# EAGLE design BBB_Proto_Cape (EAGLE 6.3)
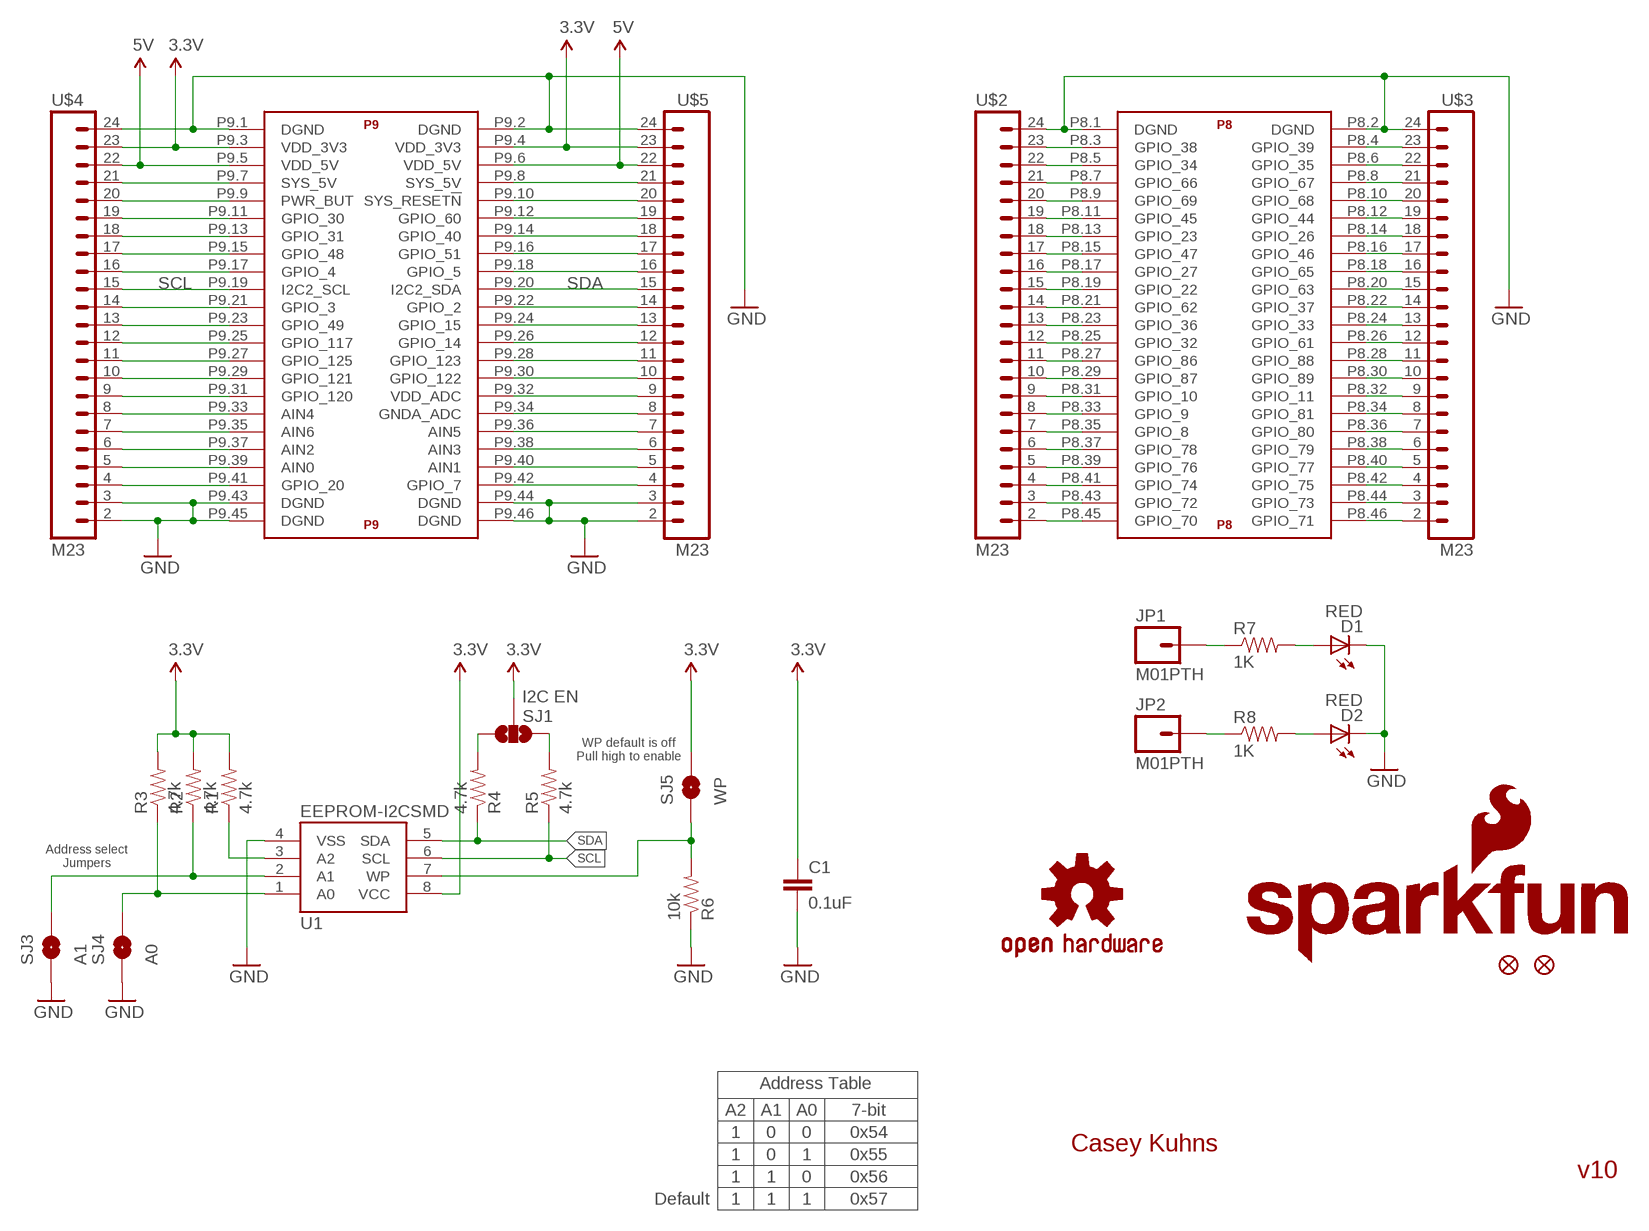
[diagram p0: schematic, sheet 1]

## Parts
C1  0.1uF  0.1UF-25V(+80/-20%)(0603)  [0603-CAP]
D1  RED  LED-RED0603  [LED-0603]
D2  RED  LED-RED0603  [LED-0603]
FID1  FIDUCIAL1X2  [FIDUCIAL-1X2]
FID2  FIDUCIAL1X2  [FIDUCIAL-1X2]
JP1  M01PTH  [1X01]
JP2  M01PTH  [1X01]
LOGO2  OSHW-LOGOS  [OSHW-LOGO-S]
LOGO3  SFE_LOGO_NAME_FLAME.1_INCH  [SFE_LOGO_NAME_FLAME_.1]
R1  4.7k  4.7KOHM1/10W1%(0603)  [0603]
R2  4.7k  4.7KOHM1/10W1%(0603)  [0603]
R3  4.7k  4.7KOHM1/10W1%(0603)  [0603]
R4  4.7k  4.7KOHM1/10W1%(0603)  [0603]
R5  4.7k  4.7KOHM1/10W1%(0603)  [0603]
R6  10k  10KOHM1/10W1%(0603)0603  [0603-RES]
R7  1K  1KOHM1/10W1%(0603)  [0603-RES]
R8  1K  1KOHM1/10W1%(0603)  [0603-RES]
SJ1  I2C EN  SOLDERJUMPER_2WAYPASTE1&2&3  [SJ_3_PASTE1&2&3]
SJ3  A1  SOLDERJUMPERNO  [SJ_2S-NO]
SJ4  A0  SOLDERJUMPERNO  [SJ_2S-NO]
SJ5  WP  SOLDERJUMPERNO  [SJ_2S-NO]
U1  EEPROM-I2CSMD  [SO08]
U$1  BEAGLE_BONE_BLACK_CAPE  [BEAGLE_BONE_BLACK_CAPE]
U$2  M23  [1X23]
U$3  M23  [1X23]
U$4  M23  [1X23]
U$5  M23  [1X23]

## Nets
3.3V: C1.1 R1.2 R2.2 R3.2 SJ1.2 SJ5.2 U1.8(VCC) U$1.P9.3(P9:VDD_3V3) U$1.P9.4(P9:VDD_3V3) U$4.23 U$5.23
5V: U$1.P9.5(P9:VDD_5V) U$1.P9.6(P9:VDD_5V) U$4.22 U$5.22
A0: R3.1 SJ4.2 U1.1(A0)
A1: R2.1 SJ3.2 U1.2(A1)
GND: C1.2 D1.C D2.C R6.1 SJ3.1 SJ4.1 U1.4(VSS) U$1.P8.1(P8:DGND) U$1.P8.2(P8:DGND) U$1.P9.1(P9:DGND) U$1.P9.2(P9:DGND) U$1.P9.43(P9:DGND) U$1.P9.44(P9:DGND) U$1.P9.45(P9:DGND) U$1.P9.46(P9:DGND) U$2.24 U$3.24 U$4.2 U$4.3 U$4.24 U$5.2 U$5.3 U$5.24
N$1: R6.2 SJ5.1 U1.7(WP)
N$2: U$1.P8.45(P8:GPIO_70) U$2.2
N$3: D1.A R7.2
N$4: U$1.P8.43(P8:GPIO_72) U$2.3
N$5: U$1.P8.41(P8:GPIO_74) U$2.4
N$6: R1.1 U1.3(A2)
N$7: D2.A R8.2
N$8: JP1.1 R7.1
N$9: U$1.P8.39(P8:GPIO_76) U$2.5
N$10: R4.2 SJ1.3
N$11: R5.2 SJ1.1
N$12: U$1.P8.37(P8:GPIO_78) U$2.6
N$13: U$1.P8.35(P8:GPIO_8) U$2.7
N$14: U$1.P8.33(P8:GPIO_9) U$2.8
N$15: U$1.P8.31(P8:GPIO_10) U$2.9
N$16: U$1.P8.29(P8:GPIO_87) U$2.10
N$17: U$1.P8.27(P8:GPIO_86) U$2.11
N$18: U$1.P8.25(P8:GPIO_32) U$2.12
N$19: U$1.P8.23(P8:GPIO_36) U$2.13
N$20: U$1.P8.21(P8:GPIO_62) U$2.14
N$21: U$1.P8.19(P8:GPIO_22) U$2.15
N$22: U$1.P8.17(P8:GPIO_27) U$2.16
N$23: U$1.P8.15(P8:GPIO_47) U$2.17
N$24: U$1.P8.13(P8:GPIO_23) U$2.18
N$25: U$1.P8.11(P8:GPIO_45) U$2.19
N$26: U$1.P8.9(P8:GPIO_69) U$2.20
N$27: U$1.P8.7(P8:GPIO_66) U$2.21
N$28: U$1.P8.5(P8:GPIO_34) U$2.22
N$29: U$1.P8.3(P8:GPIO_38) U$2.23
N$30: JP2.1 R8.1
N$31: U$1.P8.46(P8:GPIO_71) U$3.2
N$32: U$1.P8.44(P8:GPIO_73) U$3.3
N$33: U$1.P8.42(P8:GPIO_75) U$3.4
N$34: U$1.P8.40(P8:GPIO_77) U$3.5
N$35: U$1.P8.38(P8:GPIO_79) U$3.6
N$36: U$1.P8.36(P8:GPIO_80) U$3.7
N$37: U$1.P8.34(P8:GPIO_81) U$3.8
N$38: U$1.P8.32(P8:GPIO_11) U$3.9
N$39: U$1.P8.30(P8:GPIO_89) U$3.10
N$40: U$1.P8.28(P8:GPIO_88) U$3.11
N$41: U$1.P8.26(P8:GPIO_61) U$3.12
N$42: U$1.P8.24(P8:GPIO_33) U$3.13
N$43: U$1.P8.22(P8:GPIO_37) U$3.14
N$44: U$1.P8.20(P8:GPIO_63) U$3.15
N$45: U$1.P8.18(P8:GPIO_65) U$3.16
N$46: U$1.P8.16(P8:GPIO_46) U$3.17
N$47: U$1.P8.14(P8:GPIO_26) U$3.18
N$48: U$1.P8.12(P8:GPIO_44) U$3.19
N$49: U$1.P8.10(P8:GPIO_68) U$3.20
N$50: U$1.P8.8(P8:GPIO_67) U$3.21
N$51: U$1.P8.6(P8:GPIO_35) U$3.22
N$52: U$1.P8.4(P8:GPIO_39) U$3.23
N$56: U$1.P9.42(P9:GPIO_7) U$5.4
N$57: U$1.P9.40(P9:AIN1) U$5.5
N$58: U$1.P9.38(P9:AIN3) U$5.6
N$59: U$1.P9.36(P9:AIN5) U$5.7
N$60: U$1.P9.34(P9:GNDA_ADC) U$5.8
N$61: U$1.P9.32(P9:VDD_ADC) U$5.9
N$62: U$1.P9.30(P9:GPIO_122) U$5.10
N$63: U$1.P9.28(P9:GPIO_123) U$5.11
N$64: U$1.P9.26(P9:GPIO_14) U$5.12
N$65: U$1.P9.24(P9:GPIO_15) U$5.13
N$66: U$1.P9.22(P9:GPIO_2) U$5.14
N$68: U$1.P9.18(P9:GPIO_5) U$5.16
N$69: U$1.P9.16(P9:GPIO_51) U$5.17
N$70: U$1.P9.14(P9:GPIO_40) U$5.18
N$71: U$1.P9.12(P9:GPIO_60) U$5.19
N$72: U$1.P9.10(P9:SYS_RESET!N) U$5.20
N$73: U$1.P9.8(P9:SYS_5V) U$5.21
N$79: U$1.P9.41(P9:GPIO_20) U$4.4
N$80: U$1.P9.39(P9:AIN0) U$4.5
N$81: U$1.P9.37(P9:AIN2) U$4.6
N$82: U$1.P9.35(P9:AIN6) U$4.7
N$83: U$1.P9.33(P9:AIN4) U$4.8
N$84: U$1.P9.31(P9:GPIO_120) U$4.9
N$85: U$1.P9.29(P9:GPIO_121) U$4.10
N$86: U$1.P9.27(P9:GPIO_125) U$4.11
N$87: U$1.P9.25(P9:GPIO_117) U$4.12
N$88: U$1.P9.23(P9:GPIO_49) U$4.13
N$89: U$1.P9.21(P9:GPIO_3) U$4.14
N$91: U$1.P9.17(P9:GPIO_4) U$4.16
N$92: U$1.P9.15(P9:GPIO_48) U$4.17
N$93: U$1.P9.13(P9:GPIO_31) U$4.18
N$94: U$1.P9.11(P9:GPIO_30) U$4.19
N$95: U$1.P9.9(P9:PWR_BUT) U$4.20
N$96: U$1.P9.7(P9:SYS_5V) U$4.21
SCL: R5.1 U1.6(SCL) U$1.P9.19(P9:I2C2_SCL) U$4.15
SDA: R4.1 U1.5(SDA) U$1.P9.20(P9:I2C2_SDA) U$5.15

## Notes on the sheet
- WP default is off
  Pull high to enable
- Address select
  Jumpers
- Address Table
- A2 | A1 | A0 | 7-bit
- 1 | 0 | 0 | 0x54
- Casey Kuhns
- 1 | 0 | 1 | 0x55
- 1 | 1 | 0 | 0x56 | v10
- Default | 1 | 1 | 1 | 0x57

## Library data of the parts
C1 = SparkFun-Capacitors:0.1UF-25V(+80/-20%)(0603): CAP-00810 Ceramic Standard decoupling cap; PROD_ID: CAP-00810
D1 D2 = SparkFun-LED:LED-RED: Assorted Red LEDs LilyPad 1206- DIO-09912 1206- DIO-00809 0603- DIO-00819; PROD_ID: DIO-00819
FID1 FID2 = SparkFun-Aesthetics:FIDUCIAL: Fiducial Alignment Points Various fiducial points for machine vision alignment.
JP1 JP2 = SparkFun-Connectors:M01: Header 1 Standard 1-pin 0.1" header. Use with straight break away headers (SKU : PRT-00116), right angle break away headers (PRT-00553), swiss pins (PRT-00743), machine pins (PRT-00117), and female headers (PRT-00115).
LOGO2 = SparkFun-Aesthetics:OSHW-LOGO: Open Source Hardware Logo This logo indicates the piece of hardware it is found on incorporates a OSHW license and/or adheres to the definition of open source hardware found here: http://freedomdefined.org/OSHW
LOGO3 = SparkFun-Aesthetics:SFE_LOGO_NAME_FLAME: SFE Logo, name and flame This is the SparkFun full logo. The logo on the schematic will always be the same size; the package variant is the height of the flame part of the logo. Default layer for the logo on the board is tSilk.
R1-R5 = SparkFun-Resistors:4.7KOHM1/10W1%(0603): RES-07857; PROD_ID: RES-07857
R6 = SparkFun-Resistors:10KOHM1/10W1%(0603): RES-00824; PROD_ID: RES-00824; VALUE: 10K
R7 R8 = SparkFun-Resistors:1KOHM1/10W1%(0603): RES-07856; PROD_ID: RES-07856
SJ1 = SparkFun-Passives:SOLDERJUMPER_2WAY: Solder Jumper 2 way solder jumper
SJ3-SJ5 = SparkFun-Passives:SOLDERJUMPER: Solder Jumper Standard SMD solder jumper. Used to automate production. Two varients : Normally Open and Normally Closed are the same, but have different paste layers. NC will have a large amount of paste and should jumper during reflow.
U1 = SparkFun-DigitalIC:EEPROM-I2C: I2C EEPROM chips, 24LC256 (and others)
U$1 = SparkFun-Boards:BEAGLE_BONE_BLACK_CAPE
U$2-U$5 = SparkFun-Connectors:M23

## Board
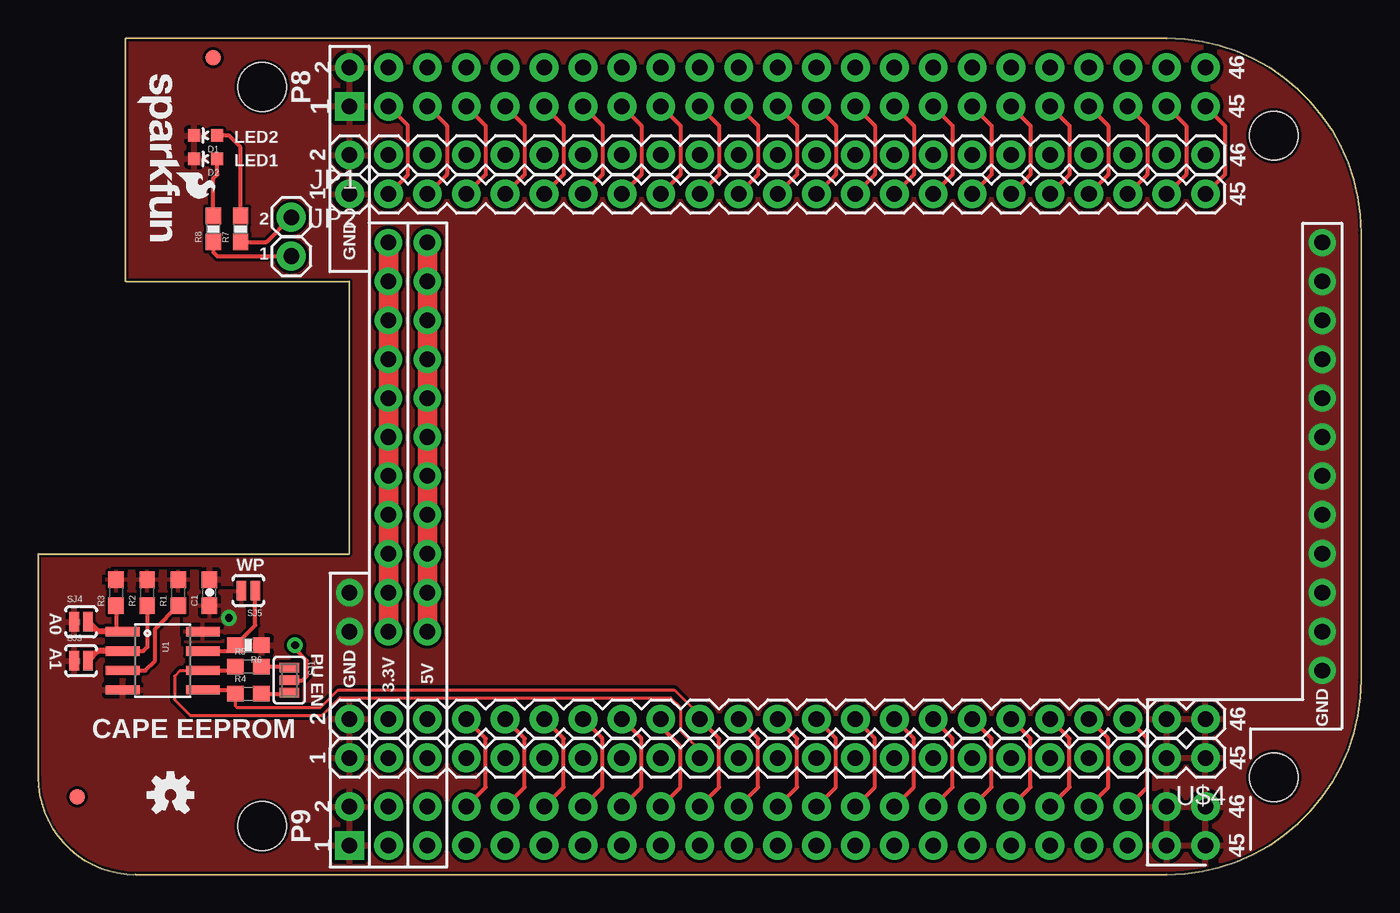
[diagram p1: board, top side]
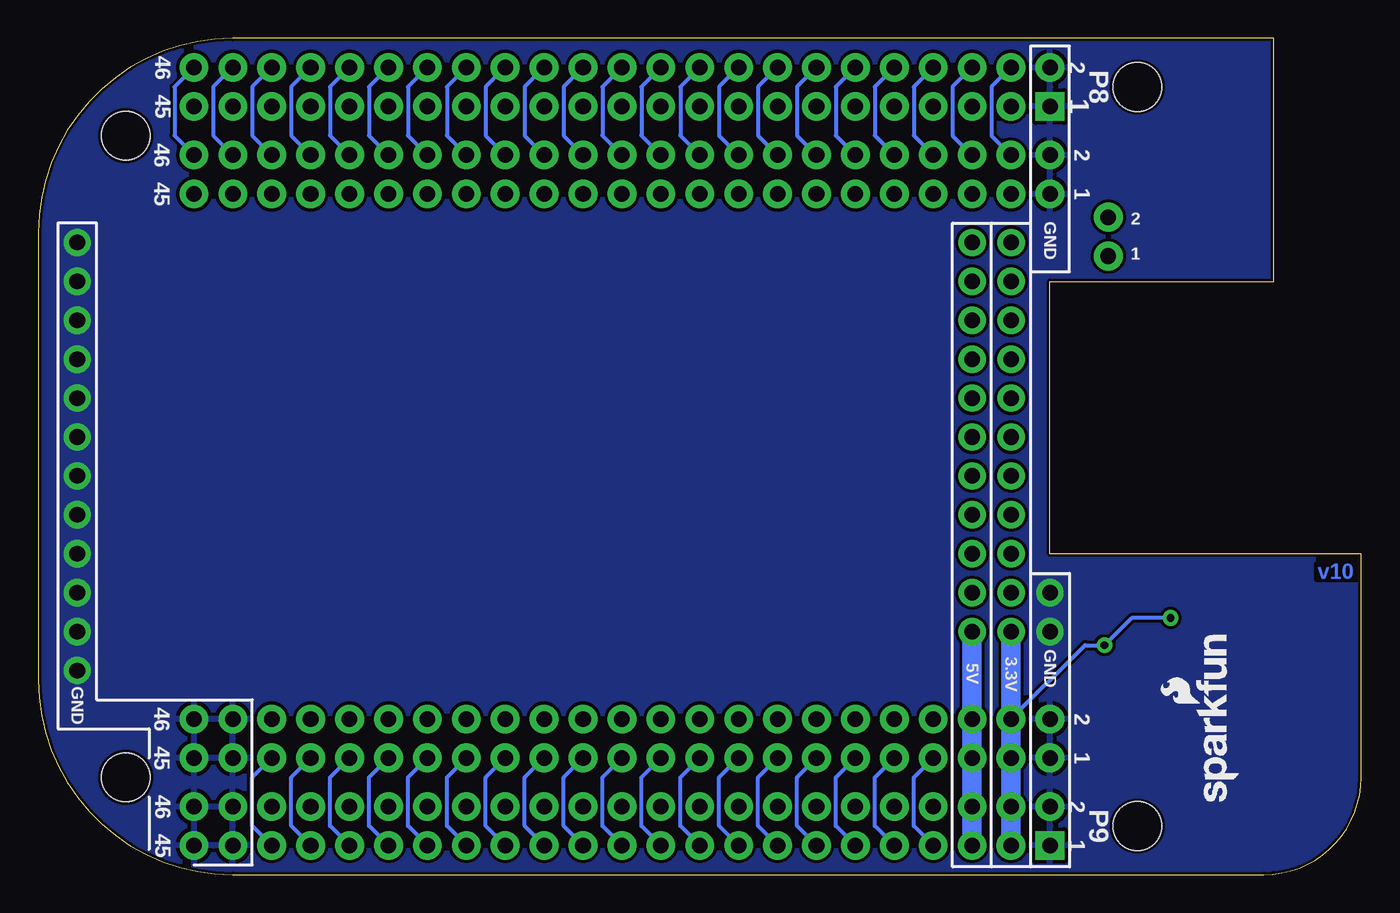
[diagram p2: board, bottom side, seen from below]

Size 86.36 x 54.61 mm. Coordinates in mm from the lower left corner, seen from the top.
Outline: 0,20.95 20.32,20.95 20.32,38.73 5.71,38.73 5.71,54.61 73.66,54.61 arc-90 86.36,41.91 86.36,12.7 arc-90 73.66,0 6.35,0 arc-90 0,6.35 0,20.95
Copper layers (1*16): Top 0.035mm / dielectric 1.5mm / Bottom 0.035mm
Design rules "SparkFun-2-layer": minimum track width 7mil, minimum drill 15mil, track to track 8mil, track to pad 8mil, pad to pad 8mil, via to via 8mil, smd to smd 8mil, copper to edge 8mil, drill to drill 8mil, minimum pad ring 12mil, minimum via ring 10mil, stop-mask expansion 4mil, vias tented up to drill 20mil, thermal gap 10mil

### Footprints (pad centres in the part's own frame; a part is rotated, then mirrored left to right if it is on the bottom)
0603-CAP = smd 1.1 x 1: 1 -0.85,0; 2 0.85,0
LED-0603 = smd 0.8 x 0.8: A 0,-0.75; C 0,0.75
FIDUCIAL-1X2 = smd 1 x 1: 1 0,0
1X01 = drill 1.016 pad 1.88: 1 0,0
0603 = smd 1.1 x 1: 1 -0.85,0; 2 0.85,0
0603-RES = smd 1.1 x 1: 1 -0.85,0; 2 0.85,0
SJ_3_PASTE1&2&3 = smd 0.635 x 1.27: 1 -0.813,0; 2 0,0; 3 0.813,0
SJ_2S-NO = smd 0.635 x 1.27: 1 -0.45,0; 2 0.45,0
SO08 = smd 0.61 x 2.21: 1 -1.905,-2.616; 2 -0.635,-2.616; 3 0.635,-2.616; 4 1.905,-2.616; 5 1.905,2.616; 6 0.635,2.616; 7 -0.635,2.616; 8 -1.905,2.616
BEAGLE_BONE_BLACK_CAPE = drill 1.016 pad 1.88 square: P8.1 20.32,50.165; P9.1 20.32,1.905 | drill 1.016 pad 1.88: P8.2 20.32,52.705; P8.3 22.86,50.165; P8.4 22.86,52.705; P8.5 25.4,50.165; P8.6 25.4,52.705; P8.7 27.94,50.165; P8.8 27.94,52.705; P8.9 30.48,50.165; P8.10 30.48,52.705; P8.11 33.02,50.165; P8.12 33.02,52.705; P8.13 35.56,50.165; P8.14 35.56,52.705; P8.15 38.1,50.165; P8.16 38.1,52.705; P8.17 40.64,50.165; P8.18 40.64,52.705; P8.19 43.18,50.165; P8.20 43.18,52.705; P8.21 45.72,50.165; P8.22 45.72,52.705; P8.23 48.26,50.165; P8.24 48.26,52.705; P8.25 50.8,50.165; P8.26 50.8,52.705; P8.27 53.34,50.165; P8.28 53.34,52.705; P8.29 55.88,50.165; P8.30 55.88,52.705; P8.31 58.42,50.165; P8.32 58.42,52.705; P8.33 60.96,50.165; P8.34 60.96,52.705; P8.35 63.5,50.165; P8.36 63.5,52.705; P8.37 66.04,50.165; P8.38 66.04,52.705; P8.39 68.58,50.165; P8.40 68.58,52.705; P8.41 71.12,50.165; P8.42 71.12,52.705; P8.43 73.66,50.165; P8.44 73.66,52.705; P8.45 76.2,50.165; P8.46 76.2,52.705; P9.2 20.32,4.445; P9.3 22.86,1.905; P9.4 22.86,4.445; P9.5 25.4,1.905; P9.6 25.4,4.445; P9.7 27.94,1.905; P9.8 27.94,4.445; P9.9 30.48,1.905; P9.10 30.48,4.445; P9.11 33.02,1.905; P9.12 33.02,4.445; P9.13 35.56,1.905; P9.14 35.56,4.445; P9.15 38.1,1.905; P9.16 38.1,4.445; P9.17 40.64,1.905; P9.18 40.64,4.445; P9.19 43.18,1.905; P9.20 43.18,4.445; P9.21 45.72,1.905; P9.22 45.72,4.445; P9.23 48.26,1.905; P9.24 48.26,4.445; P9.25 50.8,1.905; P9.26 50.8,4.445; P9.27 53.34,1.905; P9.28 53.34,4.445; P9.29 55.88,1.905; P9.30 55.88,4.445; P9.31 58.42,1.905; P9.32 58.42,4.445; P9.33 60.96,1.905; P9.34 60.96,4.445; P9.35 63.5,1.905; P9.36 63.5,4.445; P9.37 66.04,1.905; P9.38 66.04,4.445; P9.39 68.58,1.905; P9.40 68.58,4.445; P9.41 71.12,1.905; P9.42 71.12,4.445; P9.43 73.66,1.905; P9.44 73.66,4.445; P9.45 76.2,1.905; P9.46 76.2,4.445 | hole 3.175: 14.605,3.175; 80.645,6.35; 80.645,48.26; 14.605,51.435
1X23 = drill 1.016 pad 1.88: 2 -26.67,0; 3 -24.13,0; 4 -21.59,0; 5 -19.05,0; 6 -16.51,0; 7 -13.97,0; 8 -11.43,0; 9 -8.89,0; 10 -6.35,0; 11 -3.81,0; 12 -1.27,0; 13 1.27,0; 14 3.81,0; 15 6.35,0; 16 8.89,0; 17 11.43,0; 18 13.97,0; 19 16.51,0; 20 19.05,0; 21 21.59,0; 22 24.13,0; 23 26.67,0; 24 29.21,0

### Placement (x,y rotation side)
C1  11.18,18.41 90 top
D1  10.92,48.26 90 top
D2  10.92,46.74 90 top
FID1  2.54,5.08 0 top
FID2  11.43,53.34 0 top
JP1  16.51,42.93 0 top
JP2  16.51,40.39 0 top
LOGO2  8.64,5.21 0 top
LOGO3  6.35,52.7 270 top
R1  9.14,18.41 90 top
R2  7.11,18.41 90 top
R3  5.08,18.41 90 top
R4  13.72,11.81 0 top
R5  13.72,13.59 0 top
R6  13.72,14.99 180 top
R7  13.21,42.16 90 top
R8  11.43,42.16 90 top
SJ1  16.38,12.7 270 top
SJ3  2.79,13.97 0 top
SJ4  2.79,16.51 0 top
SJ5  13.72,18.54 180 top
U1  8.13,13.97 270 top
U$1  0,0 0 top
U$2  49.53,44.45 180 top
U$3  49.53,46.99 180 top
U$4  49.53,7.62 180 top
U$5  49.53,10.16 180 top
U$6  [SFE_LOGO_NAME_FLAME_.1]  7.87,4.32 90 bottom

### Tracks (layer width: path | path; a pad name or v marks a point on that pad's centre or on a via)
3.3V  (via drill 0.51, 1.02 pad 1.78)
  Top 0.254: R1.2 9.48,19.14 | SJ1.2 17.27,12.7 17.53,12.95 17.53,13.97 16.76,14.73 v16.76,14.99
  Top 1.27: v22.86,15.88 v22.86,18.41 v22.86,20.95 v22.86,23.5 v22.86,26.04 v22.86,28.57 v22.86,31.11 v22.86,33.66 v22.86,36.2 v22.86,38.73 v22.86,41.27
  Bottom 0.254: U$5.23 18.03,14.99 v16.76,14.99 14.99,16.76 v12.45,16.76
  Bottom 1.27: U$1.P9.3 U$1.P9.4 U$4.23 U$5.23 v22.86,15.88
  pour Top: 9.53,15.24 13.46,15.24 13.46,18.54 10.41,18.54 10.41,19.81 4.45,19.81 4.45,18.54 9.53,18.54
5V  (via drill 1.02 pad 1.78)
  Top 1.27: v25.4,41.27 v25.4,38.73 v25.4,36.2 v25.4,33.66 v25.4,31.11 v25.4,28.57 v25.4,26.04 v25.4,23.5 v25.4,20.95 v25.4,18.41 v25.4,15.88
  Bottom 1.27: U$1.P9.5 U$1.P9.6 U$4.22 U$5.22 v25.4,15.88
A0
  Top 0.254: R3.1 5.08,15.88 U1.1
  Top 0.406: 5.08,15.88 3.88,15.88 SJ4.2
A1
  Top 0.254: R2.1 7.11,14.86 6.86,14.61 U1.2
  Top 0.406: U1.2 3.88,14.61 SJ3.2
GND  (via drill 1.02 pad 1.78)
  other vias: 83.82,13.34 83.82,15.88 83.82,18.41 83.82,20.95 83.82,23.5 83.82,26.04 83.82,28.57 83.82,31.11 83.82,33.66 83.82,36.2 83.82,38.73 83.82,41.27 20.32,15.88 20.32,18.41
  pour Top (rank 6): 0,20.95 20.32,20.95 20.32,38.73 5.71,38.73 5.71,54.61 73.66,54.61 arc-90 86.36,41.91 86.36,12.7 arc-90 73.66,0 6.35,0 arc-90 0,6.35
  pour Bottom: 0,20.95 20.32,20.95 20.32,38.73 5.71,38.73 5.71,54.61 73.66,54.61 arc-90 86.36,41.91 86.36,12.7 arc-90 73.66,0 6.35,0 arc-90 0,6.35
N$1
  Top 0.254: SJ5.1 14.17,16.29 R6.2 12.48,14.61 U1.7
N$2
  Top 0.254: U$1.P8.45 77.47,48.9 77.47,45.72 U$2.2
N$3
  Top 0.254: R7.2 13.21,47.5 12.45,48.26 D1.A
N$4
  Top 0.254: U$1.P8.43 74.93,48.9 74.93,45.72 U$2.3
N$5
  Top 0.254: U$1.P8.41 72.39,48.9 72.39,45.72 U$2.4
N$6
  Top 0.254: U1.3 6.99,13.34 7.62,13.97 7.62,16.04 R1.1
N$7
  Top 0.254: R8.2 11.43,45.47 11.68,45.72 11.68,46.72 D2.A
N$8
  Top 0.254: R7.1 14.9,41.31 JP1.1
N$9
  Top 0.254: U$1.P8.39 69.85,48.9 69.85,45.72 U$2.5
N$10
  Top 0.254: R4.2 16.31,11.81 SJ1.3
N$11
  Top 0.254: R5.2 16.26,13.59 16.38,13.46 SJ1.1
N$12
  Top 0.254: U$1.P8.37 67.31,48.9 67.31,45.72 U$2.6
N$13
  Top 0.254: U$1.P8.35 64.77,48.9 64.77,45.72 U$2.7
N$14
  Top 0.254: U$1.P8.33 62.23,48.9 62.23,45.72 U$2.8
N$15
  Top 0.254: U$1.P8.31 59.69,48.9 59.69,45.72 U$2.9
N$16
  Top 0.254: U$1.P8.29 57.15,48.9 57.15,45.72 U$2.10
N$17
  Top 0.254: U$1.P8.27 54.61,48.9 54.61,45.72 U$2.11
N$18
  Top 0.254: U$1.P8.25 52.07,48.9 52.07,45.72 U$2.12
N$19
  Top 0.254: U$1.P8.23 49.53,48.9 49.53,45.72 U$2.13
N$20
  Top 0.254: U$1.P8.21 46.99,48.9 46.99,45.72 U$2.14
N$21
  Top 0.254: U$1.P8.19 44.45,48.9 44.45,45.72 U$2.15
N$22
  Top 0.254: U$1.P8.17 41.91,48.9 41.91,45.72 U$2.16
N$23
  Top 0.254: U$1.P8.15 39.37,48.9 39.37,45.72 U$2.17
N$24
  Top 0.254: U$1.P8.13 36.83,48.9 36.83,45.72 U$2.18
N$25
  Top 0.254: U$1.P8.11 34.29,48.9 34.29,45.72 U$2.19
N$26
  Top 0.254: U$1.P8.9 31.75,48.9 31.75,45.72 U$2.20
N$27
  Top 0.254: U$1.P8.7 29.21,48.9 29.21,45.72 U$2.21
N$28
  Top 0.254: U$1.P8.5 26.67,48.9 26.67,45.72 U$2.22
N$29
  Top 0.254: U$2.23 24.13,45.72 24.13,48.9 U$1.P8.3
N$30
  Top 0.254: R8.1 11.43,40.64 11.68,40.39 JP2.1
N$31
  Bottom 0.254: U$1.P8.46 77.47,51.44 77.47,48.26 U$3.2
N$32
  Bottom 0.254: U$1.P8.44 74.93,51.44 74.93,48.26 U$3.3
N$33
  Bottom 0.254: U$1.P8.42 72.39,51.44 72.39,48.26 U$3.4
N$34
  Bottom 0.254: U$1.P8.40 69.85,51.44 69.85,48.26 U$3.5
N$35
  Bottom 0.254: U$1.P8.38 67.31,51.44 67.31,48.26 U$3.6
N$36
  Bottom 0.254: U$1.P8.36 64.77,51.44 64.77,48.26 U$3.7
N$37
  Bottom 0.254: U$1.P8.34 62.23,51.44 62.23,48.26 U$3.8
N$38
  Bottom 0.254: U$1.P8.32 59.69,51.44 59.69,48.26 U$3.9
N$39
  Bottom 0.254: U$1.P8.30 57.15,51.44 57.15,48.26 U$3.10
N$40
  Bottom 0.254: U$1.P8.28 54.61,51.44 54.61,48.26 U$3.11
N$41
  Bottom 0.254: U$1.P8.26 52.07,51.44 52.07,48.26 U$3.12
N$42
  Bottom 0.254: U$1.P8.24 49.53,51.44 49.53,48.26 U$3.13
N$43
  Bottom 0.254: U$1.P8.22 46.99,51.44 46.99,48.26 U$3.14
N$44
  Bottom 0.254: U$1.P8.20 44.45,51.44 44.45,48.26 U$3.15
N$45
  Bottom 0.254: U$1.P8.18 41.91,51.44 41.91,48.26 U$3.16
N$46
  Bottom 0.254: U$1.P8.16 39.37,51.44 39.37,48.26 U$3.17
N$47
  Bottom 0.254: U$1.P8.14 36.83,51.44 36.83,48.26 U$3.18
N$48
  Bottom 0.254: U$1.P8.12 34.29,51.44 34.29,48.26 U$3.19
N$49
  Bottom 0.254: U$1.P8.10 31.75,51.44 31.75,48.26 U$3.20
N$50
  Bottom 0.254: U$1.P8.8 29.21,51.44 29.21,48.26 U$3.21
N$51
  Bottom 0.254: U$1.P8.6 26.67,51.44 26.67,48.26 U$3.22
N$52
  Bottom 0.254: U$1.P8.4 24.13,51.44 24.13,48.26 U$3.23
N$56
  Top 0.254: U$1.P9.42 72.39,5.71 72.39,8.89 U$5.4
N$57
  Top 0.254: U$1.P9.40 69.85,5.71 69.85,8.89 U$5.5
N$58
  Top 0.254: U$1.P9.38 67.31,5.71 67.31,8.89 U$5.6
N$59
  Top 0.254: U$1.P9.36 64.77,5.71 64.77,8.89 U$5.7
N$60
  Top 0.254: U$1.P9.34 62.23,5.71 62.23,8.89 U$5.8
N$61
  Top 0.254: U$1.P9.32 59.69,5.71 59.69,8.89 U$5.9
N$62
  Top 0.254: U$1.P9.30 57.15,5.71 57.15,8.89 U$5.10
N$63
  Top 0.254: U$1.P9.28 54.61,5.71 54.61,8.89 U$5.11
N$64
  Top 0.254: U$1.P9.26 52.07,5.71 52.07,8.89 U$5.12
N$65
  Top 0.254: U$1.P9.24 49.53,5.71 49.53,8.89 U$5.13
N$66
  Top 0.254: U$1.P9.22 46.99,5.71 46.99,8.89 U$5.14
N$68
  Top 0.254: U$1.P9.18 41.91,5.71 41.91,8.38 40.64,9.65 U$5.16
N$69
  Top 0.254: U$1.P9.16 39.37,5.71 39.37,8.89 U$5.17
N$70
  Top 0.254: U$1.P9.14 36.83,5.71 36.83,8.89 U$5.18
N$71
  Top 0.254: U$1.P9.12 34.29,5.71 34.29,8.89 U$5.19
N$72
  Top 0.254: U$1.P9.10 31.75,5.71 31.75,8.89 U$5.20
N$73
  Top 0.254: U$1.P9.8 29.21,5.71 29.21,8.89 U$5.21
N$79
  Bottom 0.254: U$1.P9.41 72.39,3.17 72.39,6.35 U$4.4
N$80
  Bottom 0.254: U$1.P9.39 69.85,3.17 69.85,6.35 U$4.5
N$81
  Bottom 0.254: U$1.P9.37 67.31,3.17 67.31,6.35 U$4.6
N$82
  Bottom 0.254: U$1.P9.35 64.77,3.17 64.77,6.35 U$4.7
N$83
  Bottom 0.254: U$1.P9.33 62.23,3.17 62.23,6.35 U$4.8
N$84
  Bottom 0.254: U$1.P9.31 59.69,3.17 59.69,6.35 U$4.9
N$85
  Bottom 0.254: U$1.P9.29 57.15,3.17 57.15,6.35 U$4.10
N$86
  Bottom 0.254: U$1.P9.27 54.61,3.17 54.61,6.35 U$4.11
N$87
  Bottom 0.254: U$1.P9.25 52.07,3.17 52.07,6.35 U$4.12
N$88
  Bottom 0.254: U$1.P9.23 49.53,3.17 49.53,6.35 U$4.13
N$89
  Bottom 0.254: U$1.P9.21 46.99,3.17 46.99,6.35 U$4.14
N$91
  Bottom 0.254: U$1.P9.17 41.91,3.17 41.91,6.35 U$4.16
N$92
  Bottom 0.254: U$1.P9.15 39.37,3.17 39.37,6.35 U$4.17
N$93
  Bottom 0.254: U$1.P9.13 36.83,3.17 36.83,6.35 U$4.18
N$94
  Bottom 0.254: U$1.P9.11 34.29,3.17 34.29,6.35 U$4.19
N$95
  Bottom 0.254: U$1.P9.9 31.75,3.17 31.75,6.35 U$4.20
N$96
  Bottom 0.254: U$1.P9.7 29.21,3.17 29.21,6.35 U$4.21
SCL
  Top 0.203: U1.6 9.27,13.34 8.89,12.95 8.89,11.43 9.91,10.41 18.54,10.41 19.68,11.56 41.27,11.56 41.91,10.92 41.91,9.4 43.18,8.13 U$4.15
  Top 0.254: U1.6 12.61,13.34 R5.1
  Bottom 0.254: U$1.P9.19 44.45,3.17 44.45,6.35 U$4.15
SDA
  Top 0.203: R4.1 12.87,11.01 12.95,10.92 18.41,10.92 19.56,12.06 41.53,12.06 43.18,10.41 U$5.15
  Top 0.254: U1.5 12.61,12.06 R4.1 | U$1.P9.20 44.45,5.71 44.45,8.89 U$5.15

### Text on the board
Bottom: v10
tPlace: LED2 | 2 | 46 | LED1 | 1 | 45 | 2 | 1 | GND | WP | A0 | A1 | PU EN | GND | 3.3V | 5V | GND | CAPE EEPROM | 2 | 46 | 1 | 45
bPlace: 2 | 46 | 1 | 45 | 2 | 1 | GND | GND | 3.3V | 5V | 2 | 46 | GND | 1 | 45